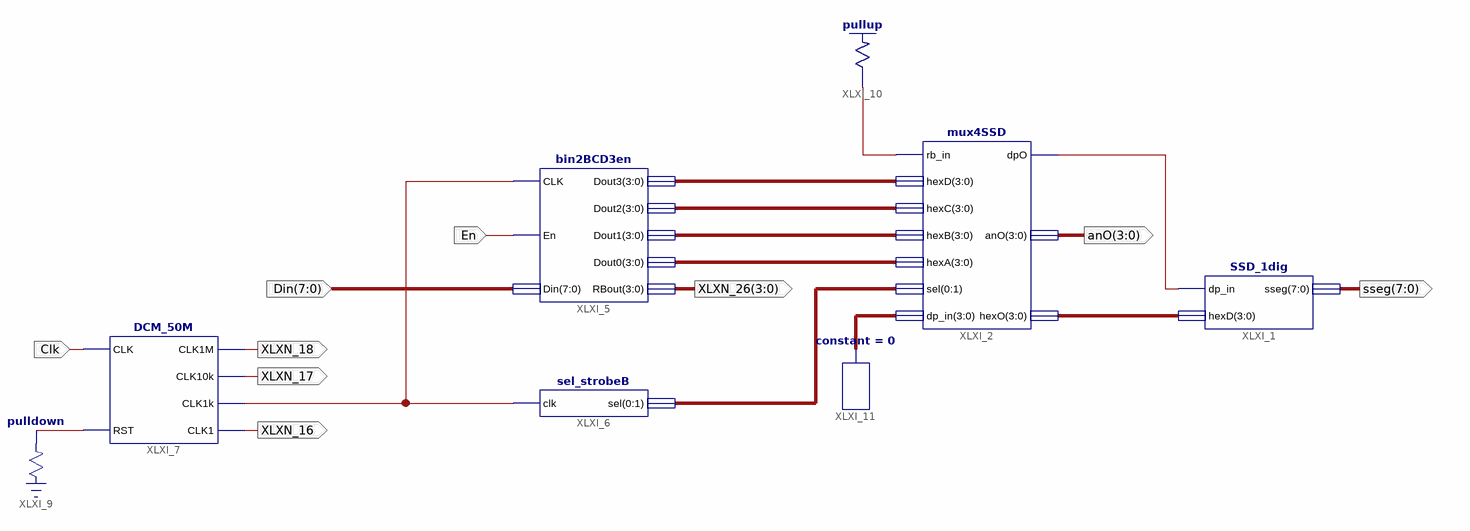
[diagram p0: schematic sheet 1]
// Xilinx ISE schematic Lab6Exp3.sch (spartan3e) as structural Verilog: 8 symbols, 9 ports
module Lab6Exp3 (
  input  [7:0] Din,
  input  En,
  input  Clk,
  output [3:0] anO,
  output [7:0] sseg,
  output XLXN_16,
  output XLXN_17,
  output XLXN_18,
  output [3:0] XLXN_26
);

  wire XLXN_4, XLXN_15, XLXN_20, XLXN_22;
  wire [1:0] XLXN_12;
  wire [3:0] XLXN_1, XLXN_6, XLXN_7, XLXN_8, XLXN_9, XLXN_11;

  SSD_1dig XLXI_1 (.dp_in(XLXN_4), .hexD(XLXN_1), .sseg(sseg));
  mux4SSD XLXI_2 (
    .rb_in(XLXN_22), .hexD(XLXN_11), .hexC(XLXN_9), .hexB(XLXN_8), .hexA(XLXN_7),
    .sel({XLXN_12[0], XLXN_12[1]}), .dp_in(XLXN_6), .dpO(XLXN_4), .anO(anO), .hexO(XLXN_1));
  bin2BCD3en XLXI_5 (
    .CLK(XLXN_15), .En(En), .Din(Din), .Dout3(XLXN_11), .Dout2(XLXN_9), .Dout1(XLXN_8), .Dout0(XLXN_7),
    .RBout(XLXN_26));
  sel_strobeB XLXI_6 (.clk(XLXN_15), .sel({XLXN_12[0], XLXN_12[1]}));
  DCM_50M XLXI_7 (.CLK(Clk), .RST(XLXN_20), .CLK1M(XLXN_18), .CLK10k(XLXN_17), .CLK1k(XLXN_15), .CLK1(XLXN_16));
  \pulldown  XLXI_9 (.O(XLXN_20));
  \pullup  XLXI_10 (.O(XLXN_22));
  constant #(.CValue("0")) XLXI_11 (.O(XLXN_6));
endmodule
